# EasyEDA schematic 1-Schematic_CessnaCitationX_Main_ESP32.json
TITLE: Main board; REV: 1.0; Date: 2018-11-17; Sheet: 1/1; Drawn By: F-ORKI
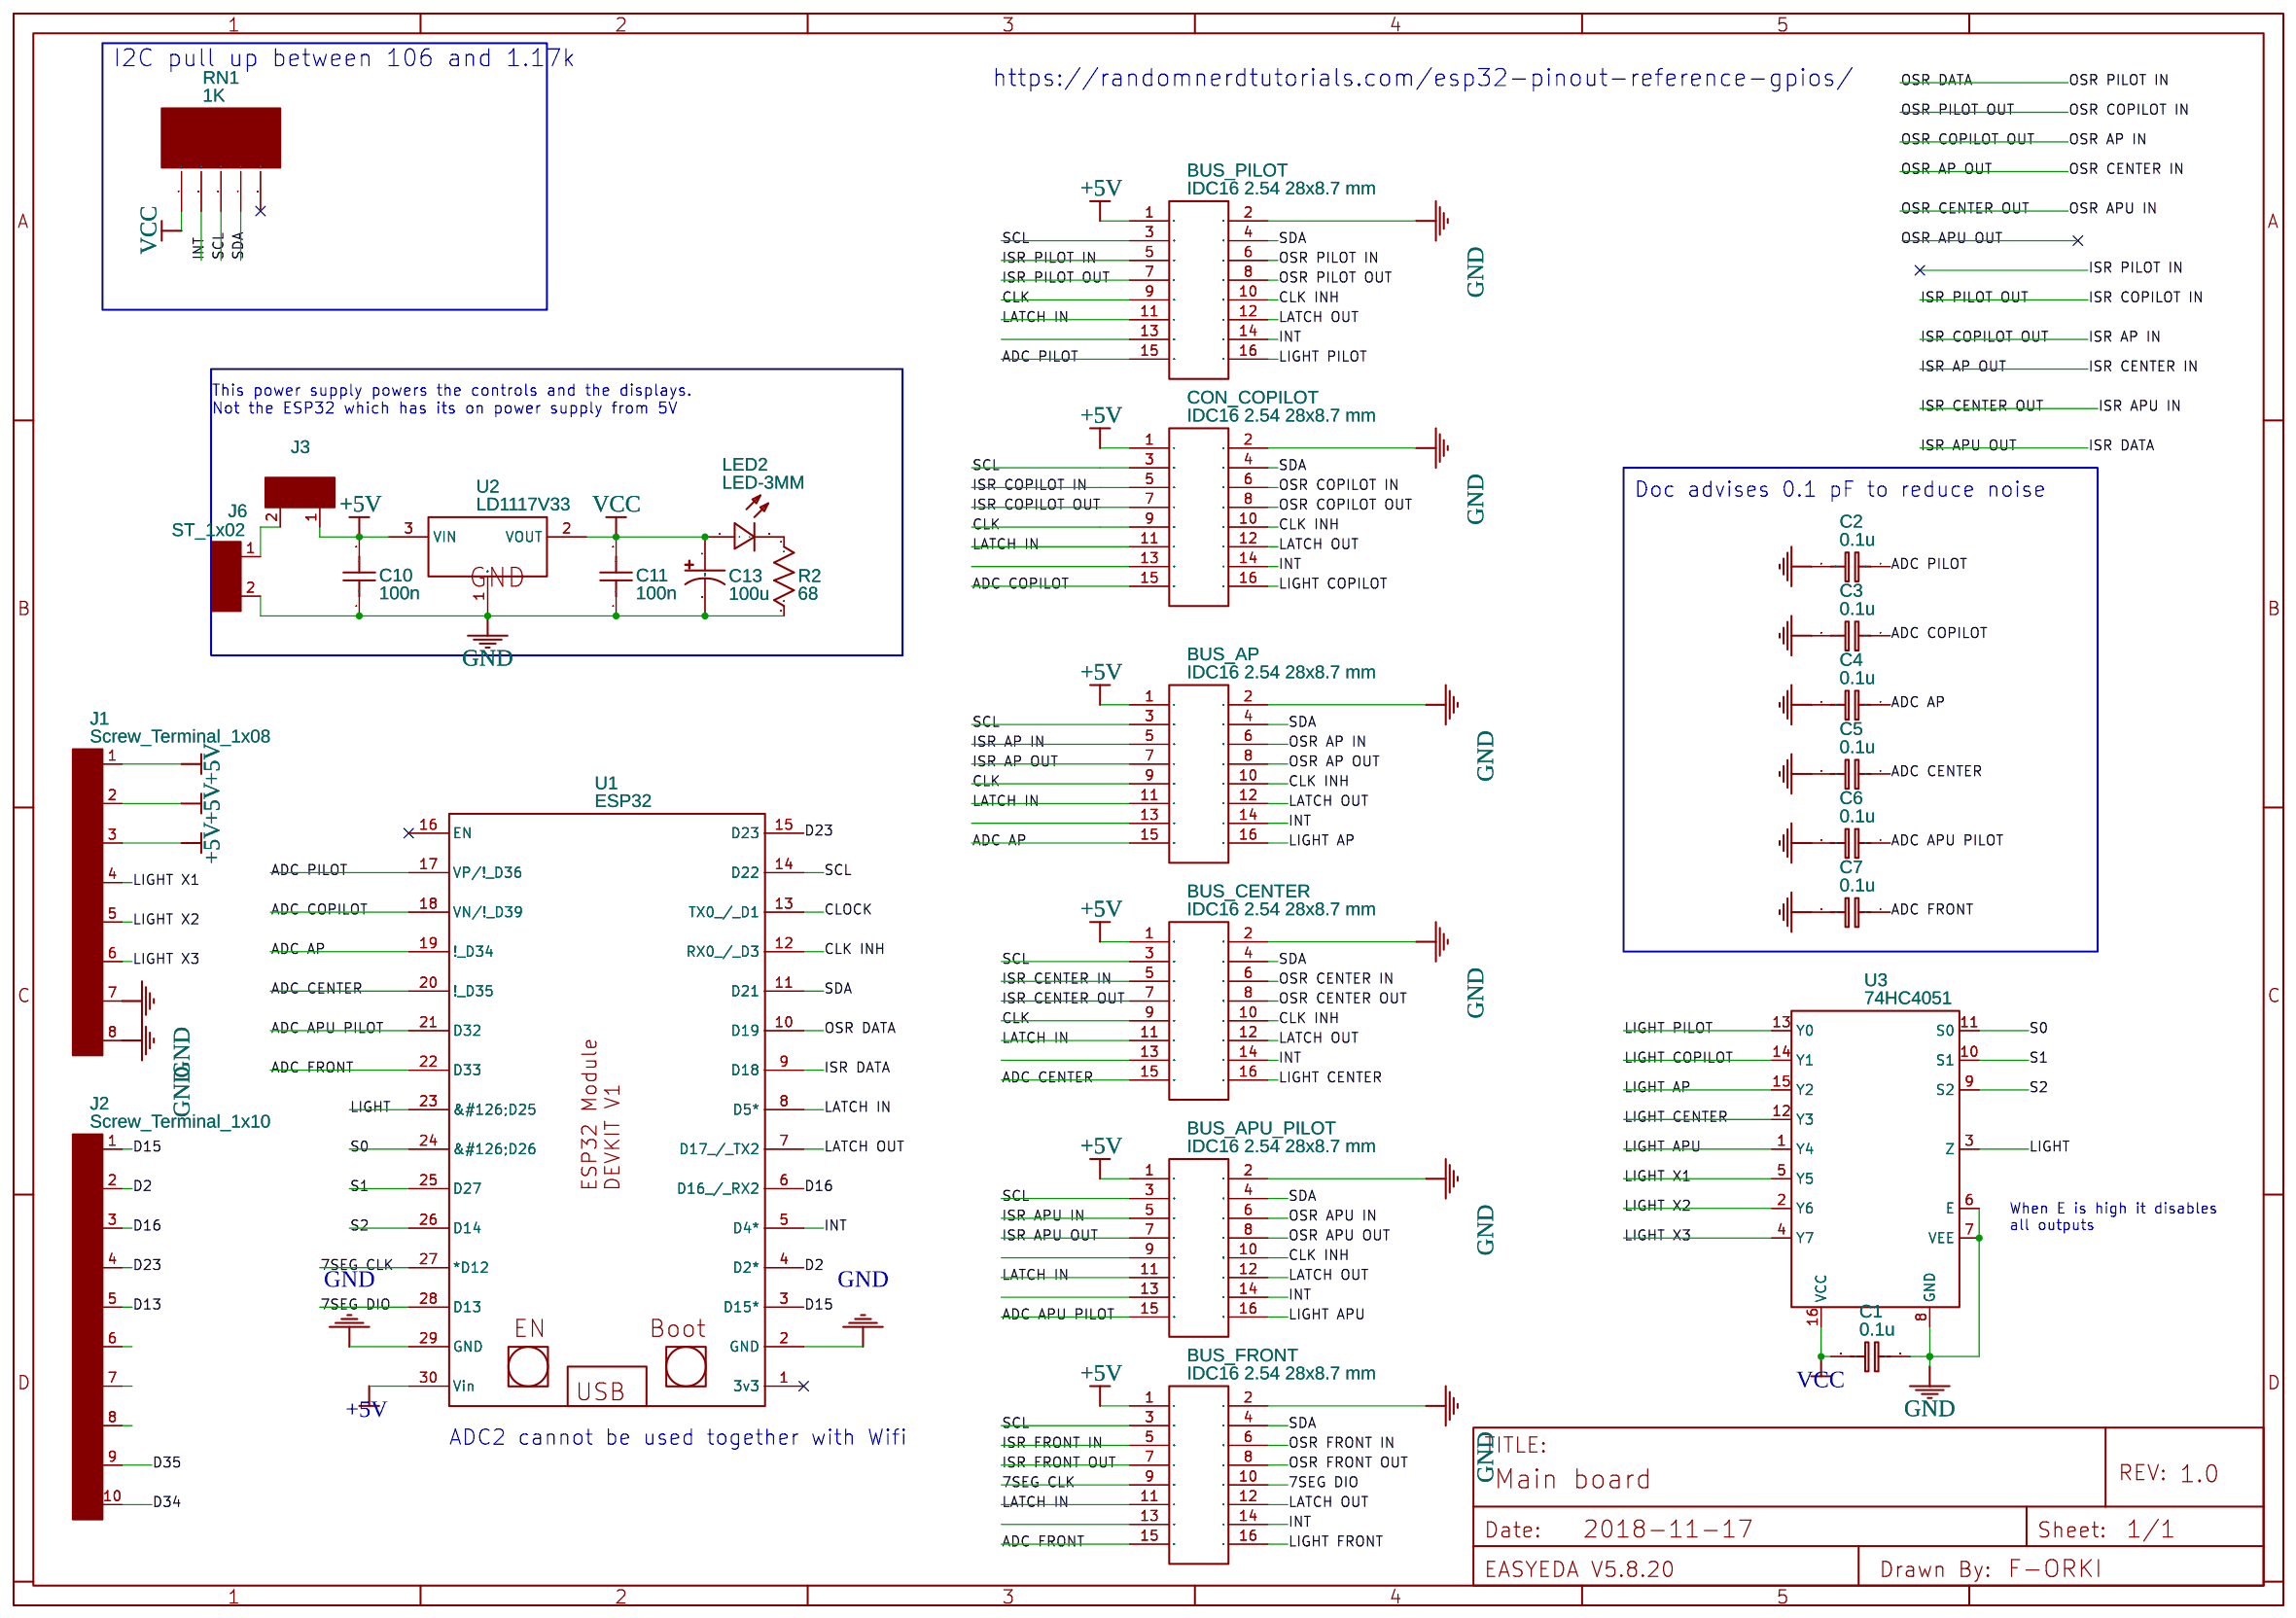
[diagram p0: schematic sheet]

## Parts
BUS_AP  IDC16 2.54 28x8.7 mm  [IDC16 2.54 28X8.7 MM]
BUS_APU_PILOT  IDC16 2.54 28x8.7 mm  [IDC16 2.54 28X8.7 MM]
BUS_CENTER  IDC16 2.54 28x8.7 mm  [IDC16 2.54 28X8.7 MM]
BUS_FRONT  IDC16 2.54 28x8.7 mm  [IDC16 2.54 28X8.7 MM]
BUS_PILOT  IDC16 2.54 28x8.7 mm  [IDC16 2.54 28X8.7 MM]
C1  0.1u  [RAD-0.1]
C2  0.1u  [RAD-0.1]
C3  0.1u  [RAD-0.1]
C4  0.1u  [RAD-0.1]
C5  0.1u  [RAD-0.1]
C6  0.1u  [RAD-0.1]
C7  0.1u  [RAD-0.1]
C10  100n  [RAD-0.1]
C11  100n  [RAD-0.1]
C13  100u  [CAP-D3.0XF1.5]
CON_COPILOT  IDC16 2.54 28x8.7 mm  [IDC16 2.54 28X8.7 MM]
J1  Screw_Terminal_1x08  [TERMINALBLOCK_PHEONIX_MPT-2.54MM_8POL]
J2  Screw_Terminal_1x10  [TERMINALBLOCK_PHEONIX_MPT-2.54MM_10POL]
J3  ST_1x02  [TERMINALBLOCK_PHEONIX_MPT-2.54MM_2POL]
J6  ST_1x02  [TERMINALBLOCK_PHEONIX_MPT-2.54MM_2POL]
LED2  LED-3MM  [LED-3MM/2.54]
R2  68  [AXIAL-0.3]
RN1  1K  [SIP-5]
U1  ESP32  [ESP32 DEV KIT V]
U2  LD1117V33  [TO-220(TO-220-3)]
U3  74HC4051  [DIL16-O]

## Library data of the parts
BUS_AP BUS_APU_PILOT BUS_CENTER BUS_FRONT BUS_PILOT CON_COPILOT = -: Manufacturer Part: ?; Contributor: julien.pitault.1984
C1-C7 = Cap_RAD-0.1_EU: Manufacturer Part: ?
C10 C11 = Cap_RAD-0.1_US: Manufacturer Part: ?
C13 = Cap_Electrolytic(TH)_D3.0XF1.5_US: Manufacturer Part: ?
J1-J3 J6 = -: Contributor: KiCAD; license: https://www.gnu.org/licenses/lgpl-2.1.html; Manufacturer Part: ?
LED2 = -: Supplier: LCSC; Manufacturer: EVERLIGHT; Manufacturer Part: 204-10SURD/S530-A3; Supplier Part: C99772
R2 = Res_AXIAL-0.3(1/8W)_US: Manufacturer Part: ?
RN1 = A05-102JP: Supplier: LCSC; Manufacturer: FH; Supplier Part: C11389
U1 = -: Manufacturer Part: ESP32 DEV KIT V1; Contributor: infoaleze; link: http://infoaleze.chez.com
U2 = -: Supplier: LCSC; Supplier Part: C283467; Manufacturer: STMicroelectronics; Contributor: LCSC
U3 = -: Contributor: Ftec; Manufacturer Part: ?

## Nets
+5V: BUS_AP.1(P1) BUS_APU_PILOT.1(P1) BUS_CENTER.1(P1) BUS_FRONT.1(P1) BUS_PILOT.1(P1) C10.2 CON_COPILOT.1(P1) J1.1 J1.2 J1.3 J3.1 U1.30(Vin) U2.3(VIN)
GND: BUS_AP.2(P2) BUS_APU_PILOT.2(P2) BUS_CENTER.2(P2) BUS_FRONT.2(P2) BUS_PILOT.2(P2) C1.1 C2.2 C3.2 C4.2 C5.2 C6.2 C7.2 C10.1 C11.1 C13.2 CON_COPILOT.2(P2) J1.7 J1.8 J6.2 R2.2 U1.2(GND) U1.29(GND) U2.1(GND) U3.6(E) U3.7(VEE) U3.8(GND)
VCC: C1.2 C11.2 C13.1 LED2.1(+) RN1.1 U2.2(VOUT) U3.16(VCC)
7SEG CLK: BUS_FRONT.9(P9) U1.27(*D12)
7SEG DIO: BUS_FRONT.10(P10) U1.28(D13)
ADC AP: BUS_AP.15 C4.1 U1.19(! D34)
ADC APU PILOT: BUS_APU_PILOT.15 C6.1 U1.21(D32)
ADC CENTER: BUS_CENTER.15 C5.1 U1.20(! D35)
ADC COPILOT: C3.1 CON_COPILOT.15 U1.18(VN/! D39)
ADC FRONT: BUS_FRONT.15 C7.1 U1.22(D33)
ADC PILOT: BUS_PILOT.15 C2.1 U1.17(VP/! D36)
CLK: BUS_AP.9(P9) BUS_CENTER.9(P9) BUS_PILOT.9(P9) CON_COPILOT.9(P9)
CLK INH: BUS_AP.10(P10) BUS_APU_PILOT.10(P10) BUS_CENTER.10(P10) BUS_PILOT.10(P10) CON_COPILOT.10(P10) U1.12(RX0 / D3)
CLOCK: U1.13(TX0 / D1)
D2: J2.2 U1.4(D2*)
D13: J2.5
D15: J2.1 U1.3(D15*)
D16: J2.3 U1.6(D16 / RX2)
D23: J2.4 U1.15(D23)
D34: J2.10
D35: J2.9
INT: BUS_AP.14 BUS_APU_PILOT.14 BUS_CENTER.14 BUS_FRONT.14 BUS_PILOT.14 CON_COPILOT.14 RN1.2 U1.5(D4*)
ISR AP IN: BUS_AP.5(P5) CON_COPILOT.7(P7)
ISR AP OUT: BUS_AP.7(P7) BUS_CENTER.5(P5)
ISR APU IN: BUS_APU_PILOT.5(P5) BUS_CENTER.7(P7)
ISR APU OUT: BUS_APU_PILOT.7(P7) U1.9(D18)
ISR COPILOT IN: BUS_PILOT.7(P7) CON_COPILOT.5(P5)
ISR FRONT IN: BUS_FRONT.5(P5)
ISR FRONT OUT: BUS_FRONT.7(P7)
ISR PILOT IN: BUS_PILOT.5(P5)
LATCH IN: BUS_AP.11 BUS_APU_PILOT.11 BUS_CENTER.11 BUS_FRONT.11 BUS_PILOT.11 CON_COPILOT.11 U1.8(D5*)
LATCH OUT: BUS_AP.12 BUS_APU_PILOT.12 BUS_CENTER.12 BUS_FRONT.12 BUS_PILOT.12 CON_COPILOT.12 U1.7(D17 / TX2)
LIGHT: U1.23(&#126;D25) U3.3(Z)
LIGHT AP: BUS_AP.16 U3.15(Y2)
LIGHT APU: BUS_APU_PILOT.16 U3.1(Y4)
LIGHT CENTER: BUS_CENTER.16 U3.12(Y3)
LIGHT COPILOT: CON_COPILOT.16 U3.14(Y1)
LIGHT FRONT: BUS_FRONT.16
LIGHT PILOT: BUS_PILOT.16 U3.13(Y0)
LIGHT X1: J1.4 U3.5(Y5)
LIGHT X2: J1.5 U3.2(Y6)
LIGHT X3: J1.6 U3.4(Y7)
OSR AP IN: BUS_AP.6(P6) CON_COPILOT.8(P8)
OSR AP OUT: BUS_AP.8(P8) BUS_CENTER.6(P6)
OSR APU IN: BUS_APU_PILOT.6(P6) BUS_CENTER.8(P8)
OSR APU OUT: BUS_APU_PILOT.8(P8)
OSR COPILOT IN: BUS_PILOT.8(P8) CON_COPILOT.6(P6)
OSR DATA: BUS_PILOT.6(P6) U1.10(D19)
OSR FRONT IN: BUS_FRONT.6(P6)
OSR FRONT OUT: BUS_FRONT.8(P8)
S0: U1.24(&#126;D26) U3.11(S0)
S1: U1.25(D27) U3.10(S1)
S2: U1.26(D14) U3.9(S2)
SCL: BUS_AP.3(P3) BUS_APU_PILOT.3(P3) BUS_CENTER.3(P3) BUS_FRONT.3(P3) BUS_PILOT.3(P3) CON_COPILOT.3(P3) RN1.3 U1.14(D22)
SDA: BUS_AP.4(P4) BUS_APU_PILOT.4(P4) BUS_CENTER.4(P4) BUS_FRONT.4(P4) BUS_PILOT.4(P4) CON_COPILOT.4(P4) RN1.4 U1.11(D21)
J6_1: J3.2 J6.1
R2_1: LED2.2(-) R2.1

Not connected (* = marked no-connect by the designer): BUS_AP 13; BUS_APU_PILOT 9(P9) 13; BUS_CENTER 13; BUS_FRONT 13; BUS_PILOT 13; CON_COPILOT 13; J2 6 7 8; RN1 5*; U1 1(3v3)* 16(EN)*

## Notes on the sheet
- I2C pull up between 106 and 1.17k
- https://randomnerdtutorials.com/esp32-pinout-reference-gpios/
- This power supply powers the controls and the displays.
  Not the ESP32 which has its on power supply from 5V
- Doc advises 0.1 pF to reduce noise
- When E is high it disables
  all outputs
- ADC2 cannot be used together with Wifi
